# Altium schematic sheet AnalogConditioning.SchDoc: Analog Signal Conditioning
size Letter; Engineer: Nathan Petersen; DocumentNumber: 13; Revision: v1.2; SheetNumber: 13; SheetTotal: 26
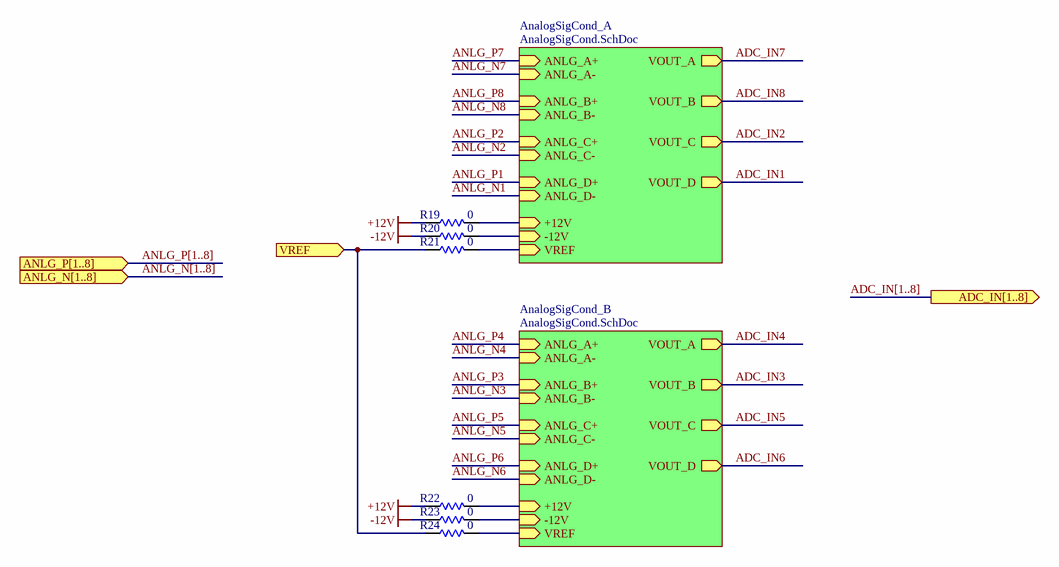
[diagram p0: AnalogConditioning.SchDoc]

## Parts
R19  value 0  [1206-RES]  (hidden comment: Resistor)
R20  value 0  [1206-RES]  (hidden comment: Resistor)
R21  value 0  [1206-RES]  (hidden comment: Resistor)
R22  value 0  [1206-RES]  (hidden comment: Resistor)
R23  value 0  [1206-RES]  (hidden comment: Resistor)
R24  value 0  [1206-RES]  (hidden comment: Resistor)

## Sub-sheets
AnalogSigCond_A = AnalogSigCond.SchDoc: +12V (in), -12V (in), VREF (in), ANLG_A+ (in), ANLG_A- (in), ANLG_B+ (in), ANLG_B- (in), ANLG_C+ (in), ANLG_C- (in), ANLG_D+ (in), ANLG_D- (in), VOUT_A (out), VOUT_B (out), VOUT_C (out), VOUT_D (out)
AnalogSigCond_B = AnalogSigCond.SchDoc: +12V (in), -12V (in), VREF (in), ANLG_A+ (in), ANLG_A- (in), ANLG_B+ (in), ANLG_B- (in), ANLG_C+ (in), ANLG_C- (in), ANLG_D+ (in), ANLG_D- (in), VOUT_A (out), VOUT_B (out), VOUT_C (out), VOUT_D (out)

## Ports
ADC_IN[1..8] (out), ANLG_N[1..8] (in), ANLG_P[1..8] (in), VREF (in)

## Nets
+12V: R19.1 R22.1
-12V: R20.1 R23.1
ADC_IN1: sheet AnalogSigCond_A/VOUT_D
ADC_IN2: sheet AnalogSigCond_A/VOUT_C
ADC_IN3: sheet AnalogSigCond_B/VOUT_B
ADC_IN4: sheet AnalogSigCond_B/VOUT_A
ADC_IN5: sheet AnalogSigCond_B/VOUT_C
ADC_IN6: sheet AnalogSigCond_B/VOUT_D
ADC_IN7: sheet AnalogSigCond_A/VOUT_A
ADC_IN8: sheet AnalogSigCond_A/VOUT_B
ANLG_N1: sheet AnalogSigCond_A/ANLG_D-
ANLG_N2: sheet AnalogSigCond_A/ANLG_C-
ANLG_N3: sheet AnalogSigCond_B/ANLG_B-
ANLG_N4: sheet AnalogSigCond_B/ANLG_A-
ANLG_N5: sheet AnalogSigCond_B/ANLG_C-
ANLG_N6: sheet AnalogSigCond_B/ANLG_D-
ANLG_N7: sheet AnalogSigCond_A/ANLG_A-
ANLG_N8: sheet AnalogSigCond_A/ANLG_B-
ANLG_P1: sheet AnalogSigCond_A/ANLG_D+
ANLG_P2: sheet AnalogSigCond_A/ANLG_C+
ANLG_P3: sheet AnalogSigCond_B/ANLG_B+
ANLG_P4: sheet AnalogSigCond_B/ANLG_A+
ANLG_P5: sheet AnalogSigCond_B/ANLG_C+
ANLG_P6: sheet AnalogSigCond_B/ANLG_D+
ANLG_P7: sheet AnalogSigCond_A/ANLG_A+
ANLG_P8: sheet AnalogSigCond_A/ANLG_B+
VREF: R21.1 R24.1 ; port VREF
NetR19_2: R19.2 ; sheet AnalogSigCond_A/+12V
NetR20_2: R20.2 ; sheet AnalogSigCond_A/-12V
NetR21_2: R21.2 ; sheet AnalogSigCond_A/VREF
NetR22_2: R22.2 ; sheet AnalogSigCond_B/+12V
NetR23_2: R23.2 ; sheet AnalogSigCond_B/-12V
NetR24_2: R24.2 ; sheet AnalogSigCond_B/VREF

## Buses and harness runs
bus ADC_IN[1..8] = port ADC_IN[1..8]
bus ANLG_N[1..8] = port ANLG_N[1..8]
bus ANLG_P[1..8] = port ANLG_P[1..8]

## Notes on the sheet
- Title:
- File:
- Sheet:
- of
- Revision:
- Time:
- Date:
- Engineer:

## Library data of the parts
R19-R24 = Resistor: Supplier 1: Digi-Key; Supplier Part Number 1: 311-0.0ERCT-ND